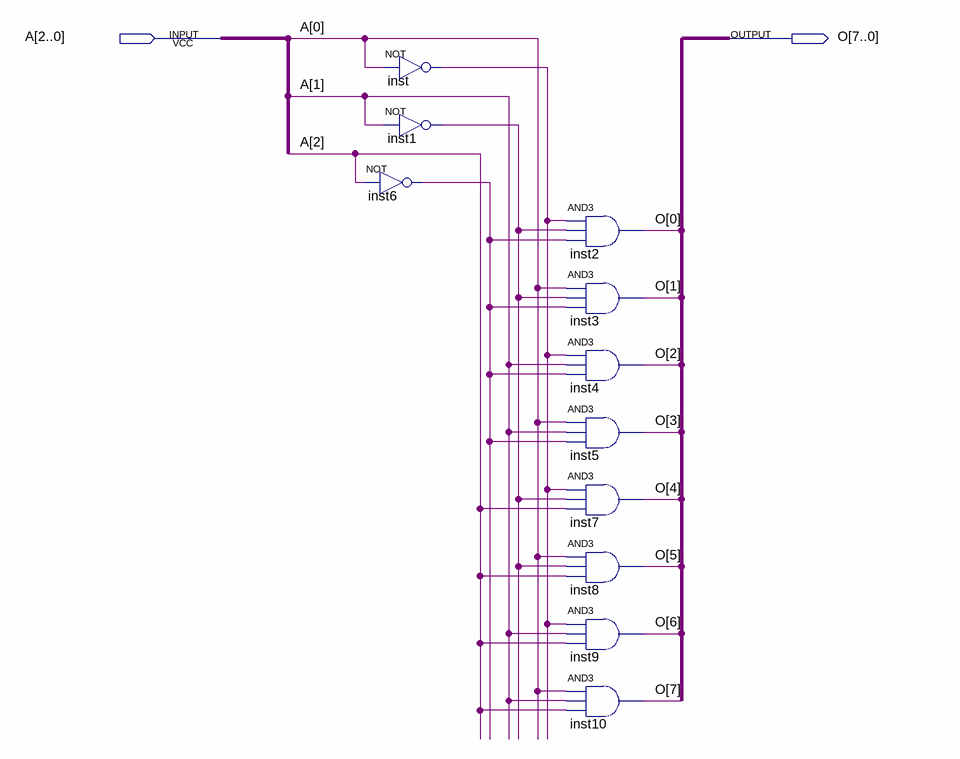
[diagram p0: schematic sheet]
// Quartus schematic demux_3b_8b.bdf as structural Verilog: 11 symbols, 2 pins
module demux_3b_8b (
  input  [2:0] A,
  output [7:0] O
);

  wire inst1_out, inst6_out, inst_out;

  not inst (inst_out, A[0]);
  not inst1 (inst1_out, A[1]);
  not inst6 (inst6_out, A[2]);
  and inst2 (O[0], inst_out, inst1_out, inst6_out);
  and inst3 (O[1], A[0], inst1_out, inst6_out);
  and inst4 (O[2], inst_out, A[1], inst6_out);
  and inst5 (O[3], A[0], A[1], inst6_out);
  and inst7 (O[4], inst_out, inst1_out, A[2]);
  and inst8 (O[5], A[0], inst1_out, A[2]);
  and inst9 (O[6], inst_out, A[1], A[2]);
  and inst10 (O[7], A[0], A[1], A[2]);
endmodule
